# EasyEDA Pro project Lib.epro

# Board PCB
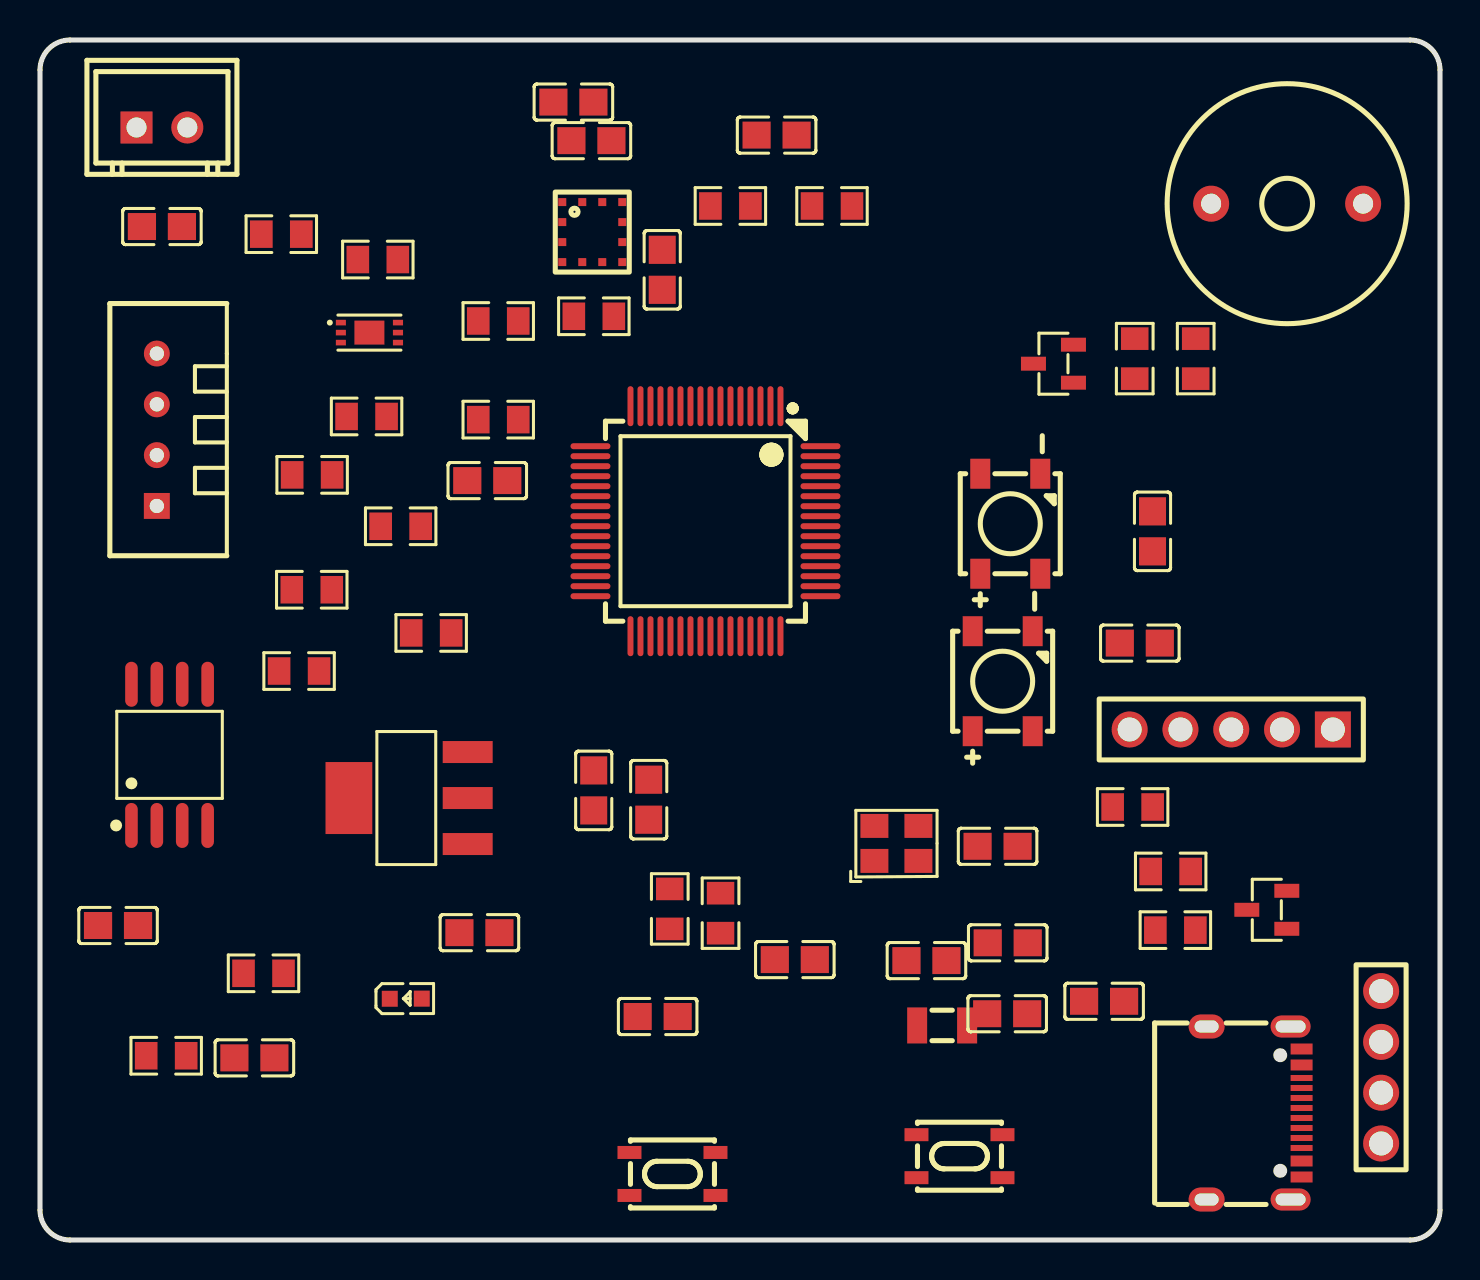
[diagram p0: board, top side]
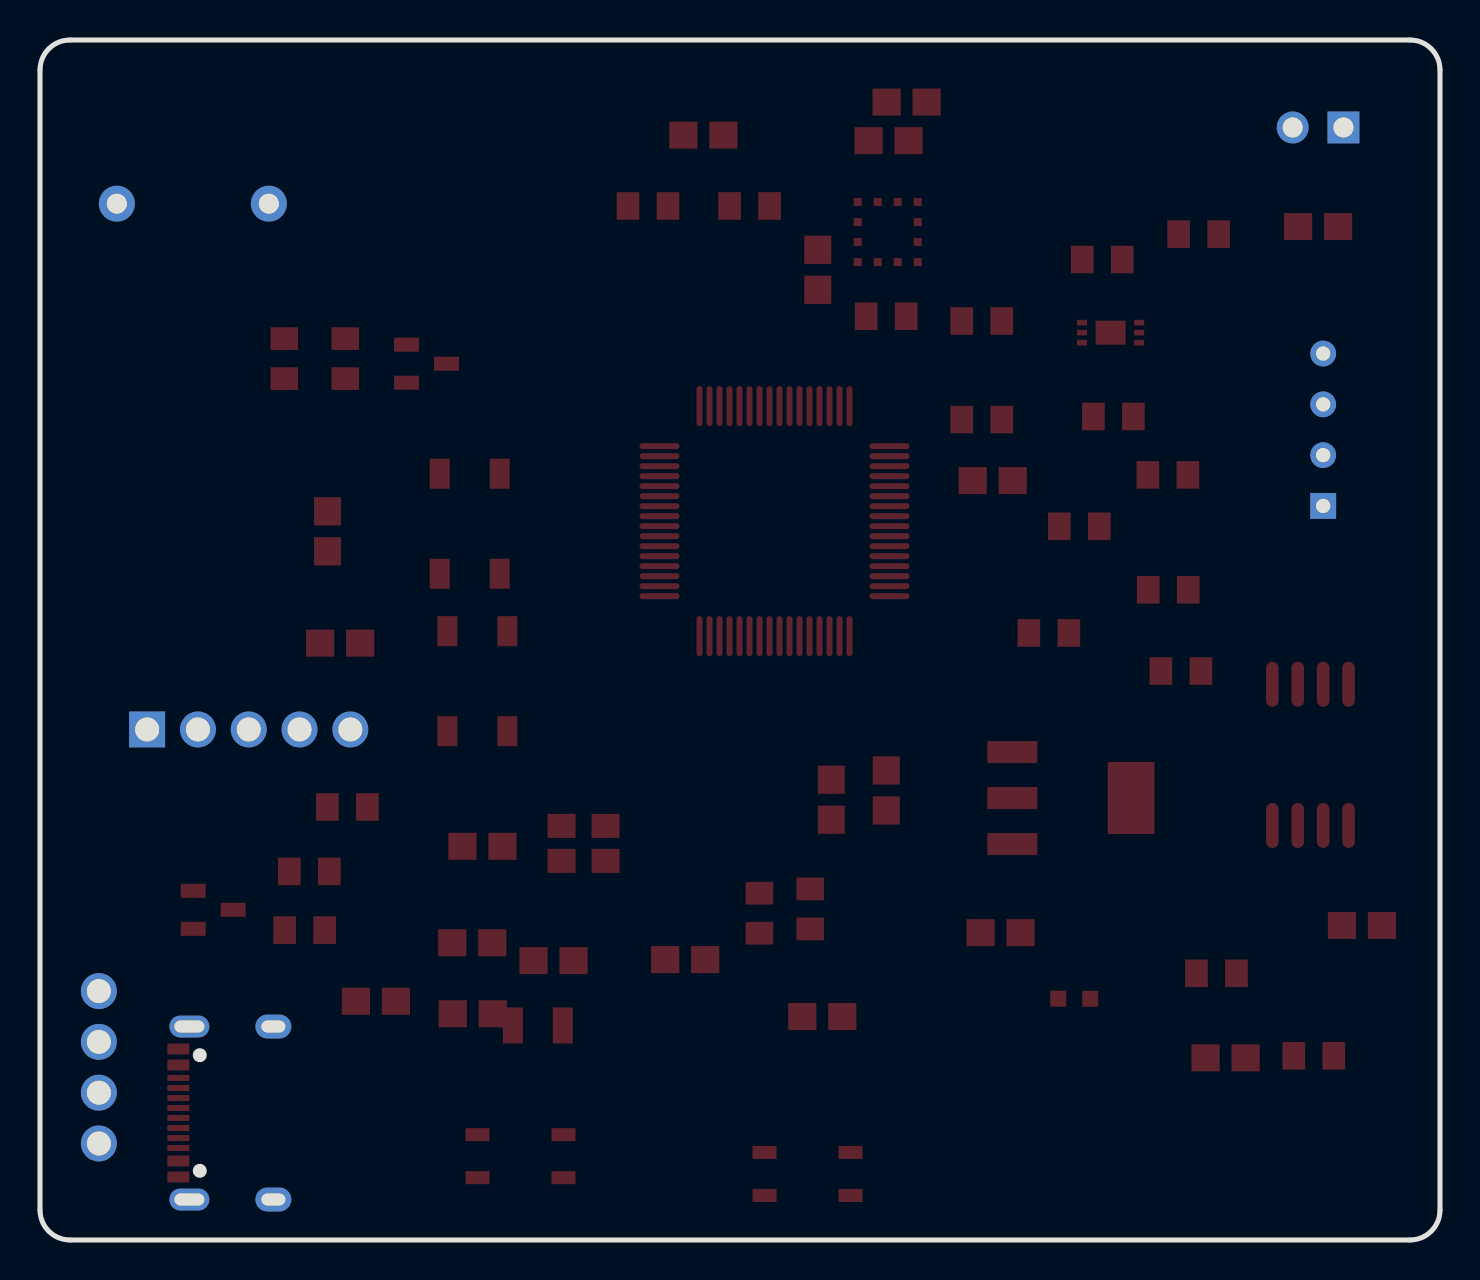
[diagram p1: board, bottom side, seen from below]

Outline 70 x 60 mm; copper layers: Top Layer, Bottom Layer. Coordinates in mm from the lower left corner of the outline.
Outline path: 0,58.5 0,1.5 arc(0.44,0.44) 1.5,0 68.5,0 arc(69.56,0.44) 70,1.5 70,58.5 arc(69.56,59.56) 68.5,60 1.5,60 arc(0.44,59.56) 0,58.5
Stack: Top Layer 0.035mm / Dielectric1 1.51mm FR4 er 4.5 / Bottom Layer 0.035mm

## Design rules (mm)
template: JLCPCB Capability(Two Layers Board)
spacing copperThickness1oz (default): track to track 0.102, other pairs 0.152 to 0.3
spacing copperThickness2oz: track to track 0.203, other pairs 0.152 to 0.3
track width copperThickness1oz (default): min 0.127, default 0.254, max 2.54
track width copperThickness2oz: min 0.203, default 0.254, max 2.54
differential pair differentialPair (default): width min 0.127, default 0.254, max 2.54; gap min 0.152, default 0.152
via viaSize (default): diameter min 0.5, default 0.61, max 10; hole min 0.3, default 0.305, max 6.3

## Placement (name value [footprint] x y rotation side)
BUZZ1  4KHZ  [BUZ-TH_BD12.0-P7.60-D0.6-FD]  62.36 51.82 0 top
C1  10uF  [C0805]  3.9 15.72 0 top
C2  10uF  [C0805]  21.97 15.37 0 top
C3  10pF  [C0805]  30.88 11.17 0 top
C4  10pF  [C0805]  37.74 14.02 0 top
C5  10pF  [C0805]  44.32 13.97 0 top
C6  10pF  [C0805]  48.36 11.31 0 top
C7  100nF  [C0805]  53.21 11.94 180 top
C8  100nF  [C0805]  48.39 14.86 0 top
C9  100nF  [C0805]  47.88 19.69 0 top
C10  100nF  [C0805]  30.44 22.02 90 top
C11  100nF  [C0805]  27.69 22.48 90 top
C12  0.1uF  [C0805]  22.36 37.97 0 top
C13  1nF  [C0805]  27.57 54.97 0 top
C14  0.1uF  [C0805]  31.11 48.51 270 top
C15  100nF  [C0805]  10.72 9.11 0 top
C16  100nF  [C0805]  54.99 29.84 0 top
C17  100nF  [C0805]  55.63 35.43 90 top
C18  100nF  [C0805]  26.67 56.9 0 top
C19  47uF  [C0805]  36.83 55.25 0 top
C20  100nF  [C0805]  6.1 50.67 0 top
CN1  W-2502S02P-B200  [CONN-TH_2P-P2.54_2501S-2P]  6.1 55.63 0 top
H1  -  [5P排针]  63.37 25.53 180 top
LED1  NCD0603R1  [LED0603-RD_RED]  18.29 12.06 0 top
LED2  XL-5050RGBC-WS2812B  [LED-SMD_4P-L5.0-W5.0-BL_XL-5050RGBC]  48.13 27.94 0 top
LED3  XL-5050RGBC-WS2812B  [LED-SMD_4P-L5.0-W5.0-BL_XL-5050RGBC]  48.51 35.81 0 top
Q1  S8050  [SOT-23-3_L2.9-W1.3-P1.90-LS2.4-BR]  61.34 16.51 0 top
Q4  AO3401  [SOT-23-3_L2.9-W1.3-P1.90-LS2.4-BR]  50.67 43.81 0 top
R1  5.1kΩ  [R0805]  13.61 38.26 0 top
R2  5.1kΩ  [R0805]  13.59 32.51 0 top
R3  5.1kΩ  [R0805]  12.95 28.45 0 top
R4  22Ω  [R0805]  18.03 35.69 0 top
R5  22Ω  [R0805]  19.56 30.35 0 top
R6  520R  [R0805]  11.18 13.33 0 top
R7  10kΩ  [R0805]  54.63 21.65 180 top
R8  10kΩ  [R0805]  34.03 16.34 90 top
R9  10kΩ  [R0805]  31.49 16.55 90 top
R10  4.7K  [R0805]  16.33 41.18 0 top
R11  1K  [R0805]  16.89 49.02 0 top
R12  4.7K  [R0805]  22.91 45.95 0 top
R13  4.7K  [R0805]  22.91 41.02 0 top
R16  10K  [R0805]  27.69 46.19 0 top
R17  10K  [R0805]  6.31 9.21 0 top
R18  10K  [R0805]  54.74 44.07 90 top
R19  20K  [R0805]  57.78 44.07 90 top
R20  10K  [R0805]  56.53 18.43 0 top
R21  1K  [R0805]  56.77 15.49 0 top
R22  10K  [R0805]  34.52 51.7 0 top
R23  10K  [R0805]  39.6 51.7 0 top
R24  10K  [R0805]  12.06 50.29 0 top
SW1  TSA017A2540A07  [SW-SMD_4P-L4.2-W3.4-P2.15-LS5.2]  45.97 4.19 180 top
SW2  TSA017A2540A07  [SW-SMD_4P-L4.2-W3.4-P2.15-LS5.2]  31.62 3.3 0 top
U1  STM32G431RBT6  [LQFP-64_L10.0-W10.0-P0.50-LS12.0-BL]  33.27 35.94 180 top
U2  AMS1117-3.3(XBLW)  [SOT-223-3_L6.5-W3.4-P2.30-LS7.0-BR-1]  18.41 22.1 0 top
U4  BH1750FVI-TR  [WSOF-6_L2.6-W1.6-P0.50-TL-EP]  16.47 45.37 0 top
U6  ML8511  [DFN-12_L4.0-W3.7-P1.00-TL]  27.61 50.4 0 top
U7  DHT11  [SENSOR-TH_DHT11]  5.84 40.51 90 top
U8  -  [CONN-TH_4P-P2.54_POGO-4P]  67.06 8.64 270 top
U9  W25Q128JVSIQ  [SOIC-8_L5.3-W5.3-P1.27-LS8.0-BL]  6.48 24.26 0 top
USB1  TYPE-C 16PIN 2MD(073)  [USB-C-SMD_TYPE-C-6PIN-2MD-073]  60.71 6.35 270 top
X1  25MHz  [OSC-SMD_4P-L3.2-W2.5-BL]  42.82 19.83 0 top
X2  -  [FC-135R_L3.2-W1.5]  45.11 10.73 0 top

## Footprints (pads in the part's own frame, mm; a bottom-side part is the same pattern mirrored in y, then rotated)
5P排针
  rect 1.8x1.8 hole 1.2: 1(-1.27,0)
  round 1.8 hole 1.2: 2(1.27,0) 3(3.81,0) 4(6.35,0) 5(8.89,0)
BUZ-TH_BD12.0-P7.60-D0.6-FD
  round 1.8 hole 1: 1(-3.8,0) 2(3.8,0)
C0805
  rect 1.41x1.35 smd: 1(-1,0) 2(1,0)
CONN-TH_2P-P2.54_2501S-2P
  rect 1.6x1.6 hole 1: 1(-1.27,0)
  round 1.6 hole 1: 2(1.27,0)
CONN-TH_4P-P2.54_POGO-4P
  round 1.8 hole 1.2: 1(-3.81,0) 2(-1.27,0) 3(1.27,0) 4(3.81,0)
DFN-12_L4.0-W3.7-P1.00-TL
  rect 0.4x0.4 smd: 1(-1.5,1.5) 2(-1.5,0.5) 3(-1.5,-0.5) 4(-1.5,-1.5) 5(-0.5,-1.5) 6(0.5,-1.5) 7(1.5,-1.5) 8(1.5,-0.5) 9(1.5,0.5) 10(1.5,1.5) 11(0.5,1.5) 12(-0.5,1.5)
FC-135R_L3.2-W1.5
  rect 1.001x1.801 smd: 1(-1.25,0) 2(1.25,0)
LED0603-RD_RED
  rect 0.8x0.8 smd: 1(-0.799,-0.004) 2(0.799,0.004)
LED-SMD_4P-L5.0-W5.0-BL_XL-5050RGBC
  rect 1x1.5 smd: 1(-1.5,-2.5) 2(1.5,-2.5) 3(1.5,2.5) 4(-1.5,2.5)
LQFP-64_L10.0-W10.0-P0.50-LS12.0-BL
  oval 0.3x2 smd: 1(-3.75,-5.75) 2(-3.25,-5.75) 3(-2.75,-5.75) 4(-2.25,-5.75) 5(-1.75,-5.75) 6(-1.25,-5.75) 7(-0.75,-5.75) 8(-0.25,-5.75) 9(0.25,-5.75) 10(0.75,-5.75) 11(1.25,-5.75) 12(1.75,-5.75) 13(2.25,-5.75) 14(2.75,-5.75) 15(3.25,-5.75) 16(3.75,-5.75) 33(3.75,5.75) 34(3.25,5.75) 35(2.75,5.75) 36(2.25,5.75) 37(1.75,5.75) 38(1.25,5.75) 39(0.75,5.75) 40(0.25,5.75) 41(-0.25,5.75) 42(-0.75,5.75) 43(-1.25,5.75) 44(-1.75,5.75) 45(-2.25,5.75) 46(-2.75,5.75) 47(-3.25,5.75) 48(-3.75,5.75)
  oval 2x0.3 smd: 17(5.75,-3.75) 18(5.75,-3.25) 19(5.75,-2.75) 20(5.75,-2.25) 21(5.75,-1.75) 22(5.75,-1.25) 23(5.75,-0.75) 24(5.75,-0.25) 25(5.75,0.25) 26(5.75,0.75) 27(5.75,1.25) 28(5.75,1.75) 29(5.75,2.25) 30(5.75,2.75) 31(5.75,3.25) 32(5.75,3.75) 49(-5.75,3.75) 50(-5.75,3.25) 51(-5.75,2.75) 52(-5.75,2.25) 53(-5.75,1.75) 54(-5.75,1.25) 55(-5.75,0.75) 56(-5.75,0.25) 57(-5.75,-0.25) 58(-5.75,-0.75) 59(-5.75,-1.25) 60(-5.75,-1.75) 61(-5.75,-2.25) 62(-5.75,-2.75) 63(-5.75,-3.25) 64(-5.75,-3.75)
OSC-SMD_4P-L3.2-W2.5-BL
  rect 1.4x1.2 smd: 1(-1.1,-0.875) 2(1.1,-0.875) 3(1.1,0.875) 4(-1.1,0.875)
R0805
  rect 1.133x1.377 smd: 1(-1,0) 2(1,0)
SENSOR-TH_DHT11
  rect 1.296x1.296 hole 0.711: 1(-3.81,0)
  round 1.296 hole 0.711: 2(-1.27,0) 3(1.27,0) 4(3.81,0)
SOIC-8_L5.3-W5.3-P1.27-LS8.0-BL
  oval 0.63x2.25 smd: 1(-1.905,-3.53) 2(-0.635,-3.53) 3(0.635,-3.53) 4(1.905,-3.53) 5(1.905,3.53) 6(0.635,3.53) 7(-0.635,3.53) 8(-1.905,3.53)
SOT-23-3_L2.9-W1.3-P1.90-LS2.4-BR
  rect 1.25x0.7 smd: 1(1,-0.95) 2(1,0.95) 3(-1,0)
SOT-223-3_L6.5-W3.4-P2.30-LS7.0-BR-1
  rect 2.5x1.1 smd: 1(2.97,-2.3) 2(2.97,0) 3(2.97,2.3)
  rect 2.34x3.6 smd: 2(-2.97,0)
SW-SMD_4P-L4.2-W3.4-P2.15-LS5.2
  rect 1.2x0.65 smd: 1(-2.15,1.075) 2(2.15,1.075) 3(-2.15,-1.075) 4(2.15,-1.075)
USB-C-SMD_TYPE-C-6PIN-2MD-073
  rect 0.55x1.1 smd: 1(-3.2,2.375) 2(-2.4,2.375) 11(2.4,2.375) 12(3.2,2.375)
  rect 0.3x1.1 smd: 3(-1.75,2.375) 4(-1.25,2.375) 5(-0.75,2.375) 6(-0.25,2.375) 7(0.25,2.375) 8(0.75,2.375) 9(1.25,2.375) 10(1.75,2.375)
  oval 1.1x2 hole 0.6x1.5: 13(-4.325,1.825) 14(4.325,1.825)
  oval 1.2x1.8 hole 0.6x1.2: 13(-4.325,-2.375) 14(4.325,-2.375)
WSOF-6_L2.6-W1.6-P0.50-TL-EP
  rect 0.505x0.28 smd: 1(-1.427,0.5) 2(-1.427,0) 3(-1.427,-0.5) 4(1.427,-0.5) 5(1.427,0) 6(1.427,0.5)
  rect 1.5x1.2 smd: 7(0,0)

## Nets
3.3V: BUZZ1.1 C2.2 C8.1 C9.1 C10.1 C11.1 C14.1 C15.1 C18.1 C20.1 R6.2 R7.1 R11.1 R12.2 R13.2 R16.2 R17.1 R24.2 SW2.2 U1.16 U1.28 U1.29 U1.32 U1.48 U1.64 U2.2 U4.1 U6.7 U7.1 U8.2 U9.3 U9.7 U9.8
5V: C1.1 C16.2 C17.2 LED2.3 LED3.3 Q4.2 R18.2 U2.3 USB1.2 USB1.11
GND: C1.2 C2.1 C3.1 C4.1 C5.1 C6.2 C7.2 C8.2 C9.2 C10.2 C11.2 C12.1 C13.1 C14.2 C15.2 C16.1 C17.1 C18.2 C20.2 CN1.1 LED1.1 LED2.1 LED3.1 Q1.2 R1.2 R2.2 R3.2 R8.1 R9.1 R10.1 R20.2 SW1.3 U1.15 U1.27 U1.31 U1.47 U1.63 U2.1 U4.3 U6.5 U7.4 U8.1 U9.4 USB1.1 USB1.12 USB1.13 USB1.14 X1.2 X1.4
ADDR: R10.2 U1.42 U4.2
BEEP: R21.1 U1.35
BOOT0: R8.2 SW2.3 U1.61
BOOT1: R9.2 U1.26
DATA: R17.2 U1.9 U7.2
FAN: R19.1 U1.12
JTCK: H1.2 U1.50
JTDI: H1.3 U1.51
JTDO: H1.4 U1.56
JTMS: H1.1 U1.49
JTRST: H1.5 U1.57
ML8511_OUT: U1.13 U6.8
NRST: C7.1 R7.2 SW1.2 U1.7
OSC32_IN: C6.1 U1.3 X2.2
OSC32_OUT: C5.2 U1.4 X2.1
OSC_IN: C3.2 U1.5 X1.3
OSC_OUT: C4.2 U1.6 X1.1
SBU1: R3.1 USB1.3 USB1.9
SCL: R12.1 U1.40 U4.6 U8.3
SDA: R13.1 U1.41 U4.4 U8.4
SPI_MISO: U1.20 U9.2
SPI_MOSI: U1.21 U9.5
SPI_SCK: U1.19 U9.6
ST_USB_D+: R5.2 U1.46
ST_USB_D-: R4.2 U1.45
TYPE_C_D+: R5.1 USB1.6 USB1.8
TYPE_C_D-: R4.1 USB1.5 USB1.7
WS2812B: LED3.2 U1.8
$1N2884: R1.1 USB1.4
$1N2893: R2.1 USB1.10
$1N3702: C12.2 R11.2 U4.5
$1N3835: LED1.2 R6.1
$1N4038: CN1.2 Q4.3
$1N4040: Q4.1 R18.1 R19.2
$1N4351: C13.2 U6.10
$1N4422: R16.1 U6.4
$1N4931: LED2.2 LED3.4
$1N5246: Q1.1 R20.1 R21.2
$1N5250: BUZZ1.2 Q1.3
$1N13142: R24.1 U9.1

Pads without a net: C19 1 2; LED2 4; R22 1 2; R23 1 2; SW1 1 4; SW2 1 4; U1 1 2 10 11 14 17 18 22 23 24 25 30 33 34 36 37 38 39 43 44 52 53 54 55 58 59 60 62; U4 7; U6 1 2 3 6 9 11 12; U7 3
